# Altium schematic sheet Peak Detector.SchDoc
size A4
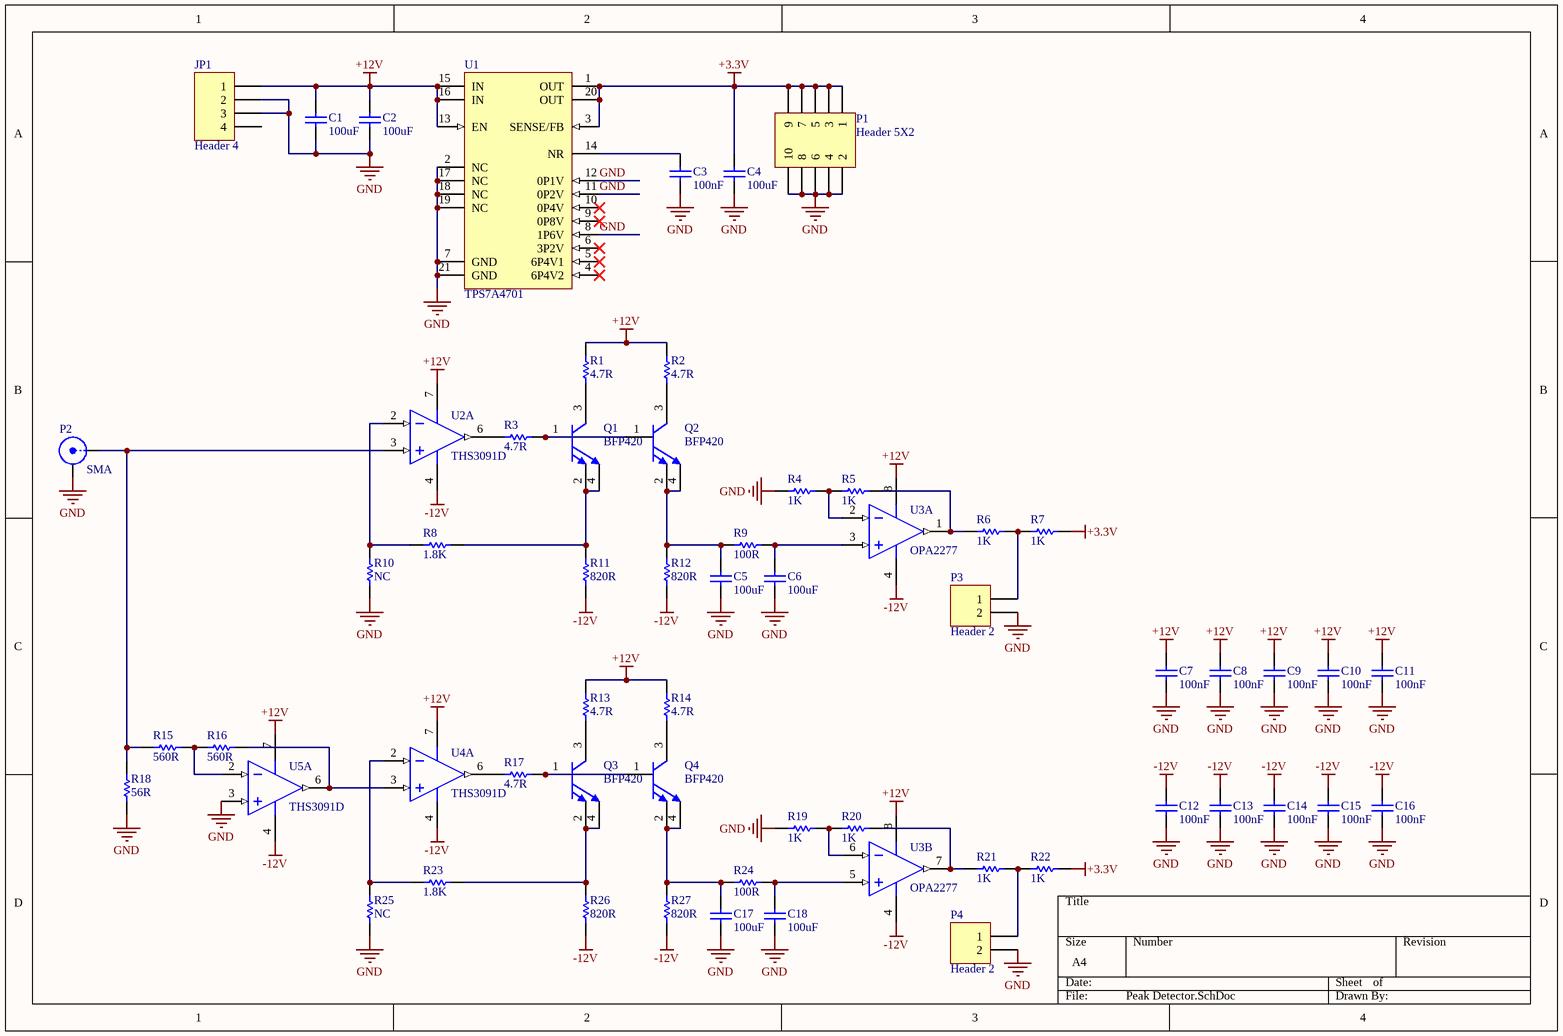
[diagram p0: Peak Detector.SchDoc]

## Parts
C1  100uF  [CAPC3225]
C2  100uF  [CAPC3225]
C3  100nF  [CAPC0603(1608)55_M]
C4  100uF  [CAPC3225]
C5  100uF  [CAPC3225]
C6  100uF  [CAPC3225]
C7  100nF  [CAPC0603(1608)55_M]
C8  100nF  [CAPC0603(1608)55_M]
C9  100nF  [CAPC0603(1608)55_M]
C10  100nF  [CAPC0603(1608)55_M]
C11  100nF  [CAPC0603(1608)55_M]
C12  100nF  [CAPC0603(1608)55_M]
C13  100nF  [CAPC0603(1608)55_M]
C14  100nF  [CAPC0603(1608)55_M]
C15  100nF  [CAPC0603(1608)55_M]
C16  100nF  [CAPC0603(1608)55_M]
C17  100uF  [CAPC3225]
C18  100uF  [CAPC3225]
JP1  Header 4  [3.96-4]
P1  Header 5X2  [HDR2X5]
P2  SMA  [SMA-V]
P3  Header 2  [HDR1X2]
P4  Header 2  [HDR1X2]
Q1  BFP420  [SOT343]
Q2  BFP420  [SOT343]
Q3  BFP420  [SOT343]
Q4  BFP420  [SOT343]
R1  4.7R  [RESC0603(1608)_M]
R2  4.7R  [RESC0603(1608)_M]
R3  4.7R  [RESC0603(1608)_M]
R4  1K  [RESC0603(1608)_M]
R5  1K  [RESC0603(1608)_M]
R6  1K  [RESC0603(1608)_M]
R7  1K  [RESC0603(1608)_M]
R8  1.8K  [RESC0603(1608)_M]
R9  100R  [RESC0603(1608)_M]
R10  NC  [RESC0603(1608)_M]
R11  820R  [RESC0603(1608)_M]
R12  820R  [RESC0603(1608)_M]
R13  4.7R  [RESC0603(1608)_M]
R14  4.7R  [RESC0603(1608)_M]
R15  560R  [RESC0603(1608)_M]
R16  560R  [RESC0603(1608)_M]
R17  4.7R  [RESC0603(1608)_M]
R18  56R  [RESC0603(1608)_M]
R19  1K  [RESC0603(1608)_M]
R20  1K  [RESC0603(1608)_M]
R21  1K  [RESC0603(1608)_M]
R22  1K  [RESC0603(1608)_M]
R23  1.8K  [RESC0603(1608)_M]
R24  100R  [RESC0603(1608)_M]
R25  NC  [RESC0603(1608)_M]
R26  820R  [RESC0603(1608)_M]
R27  820R  [RESC0603(1608)_M]
U1  TPS7A4701  [QFN20]
U2  THS3091D  [SOIC8]  (part A of 2)
U3  OPA2277  [SOIC8]  (parts A,B of 2)
U4  THS3091D  [SOIC8]  (part A of 2)
U5  THS3091D  [SOIC8]  (part A of 2)

## Nets
+3.3V: C4.2 P1.1 P1.3 P1.5 P1.7 P1.9 R7.1 R22.1 U1.1(OUT) U1.3(SENSE/FB) U1.20(OUT)
+12V: C1.2 C2.2 C7.2 C8.2 C9.2 C10.2 C11.2 JP1.1 R1.2 R2.2 R13.2 R14.2 U1.13(EN) U1.15(IN) U1.16(IN) U2.7(VS+) U3.8(V+) U4.7(VS+) U5.7(VS+)
-12V: C12.2 C13.2 C14.2 C15.2 C16.2 R11.1 R12.1 R26.1 R27.1 U2.4(VS-) U3.4(V-) U4.4(VS-) U5.4(VS-)
GND: C1.1 C2.1 C3.1 C4.1 C5.1 C6.1 C7.1 C8.1 C9.1 C10.1 C11.1 C12.1 C13.1 C14.1 C15.1 C16.1 C17.1 C18.1 JP1.2 JP1.3 P1.2 P1.4 P1.6 P1.8 P1.10 P2.2(Y) P3.2 P4.2 R4.2 R10.2 R18.2 R19.2 R25.2 U1.2(NC) U1.7(GND) U1.8(1P6V) U1.11(0P2V) U1.12(0P1V) U1.17(NC) U1.18(NC) U1.19(NC) U1.21(GND) U5.3(VIN+)
NetC3_2: C3.2 U1.14(NR)
NetC5_2: C5.2 Q2.2(E) Q2.4(E) R9.2 R12.2
NetC6_2: C6.2 R9.1 U3.3(IN_A+)
NetC17_2: C17.2 Q4.2(E) Q4.4(E) R24.2 R27.2
NetC18_2: C18.2 R24.1 U3.5(IN_B+)
NetP2_1: P2.1(X) R15.2 R18.1 U2.3(VIN+)
NetP3_1: P3.1 R6.1 R7.2
NetP4_1: P4.1 R21.1 R22.2
NetQ1_1: Q1.1(B) Q2.1(B) R3.1
NetQ1_2: Q1.2(E) Q1.4(E) R8.1 R11.2
NetQ1_3: Q1.3(C) R1.1
NetQ2_3: Q2.3(C) R2.1
NetQ3_1: Q3.1(B) Q4.1(B) R17.1
NetQ3_2: Q3.2(E) Q3.4(E) R23.1 R26.2
NetQ3_3: Q3.3(C) R13.1
NetQ4_3: Q4.3(C) R14.1
NetR3_2: R3.2 U2.6(VOUT)
NetR4_1: R4.1 R5.2 U3.2(IN_A-)
NetR5_1: R5.1 R6.2 U3.1(OUT_A)
NetR8_2: R8.2 R10.1 U2.2(VIN-)
NetR15_1: R15.1 R16.2 U5.2(VIN-)
NetR16_1: R16.1 U4.3(VIN+) U5.6(VOUT)
NetR17_2: R17.2 U4.6(VOUT)
NetR19_1: R19.1 R20.2 U3.6(IN_B-)
NetR20_1: R20.1 R21.2 U3.7(OUT_B)
NetR23_2: R23.2 R25.1 U4.2(VIN-)

Not connected (* = marked no-connect by the designer): JP1 4; U1 4(6P4V2)* 5(6P4V1)* 6(3P2V)* 9(0P8V)* 10(0P4V)*

## Library data of the parts
C1-C18 = CAP
JP1 = Header 4: Header, 4-Pin; Manufacturer: Generic Components; Class: Connector
P1 = Header 5X2: Header, 5-Pin, Dual row; LatestRevisionDate: 17-Jul-2002; LatestRevisionNote: Re-released for DXP Platform.; Publisher: Altium Limited
P3 P4 = Header 2: Header, 2-Pin; LatestRevisionDate: 17-Jul-2002; LatestRevisionNote: Re-released for DXP Platform.; Publisher: Altium Limited
R1-R27 = RES
U2 U4 U5 = THS3201
U3 = OP2
P2 = SMA: LatestRevisionDate: 17-Jul-2002; LatestRevisionNote: Re-released for DXP Platform.; Publisher: Altium Limited